# EAGLE design Regensensor (EAGLE 7.7.0)
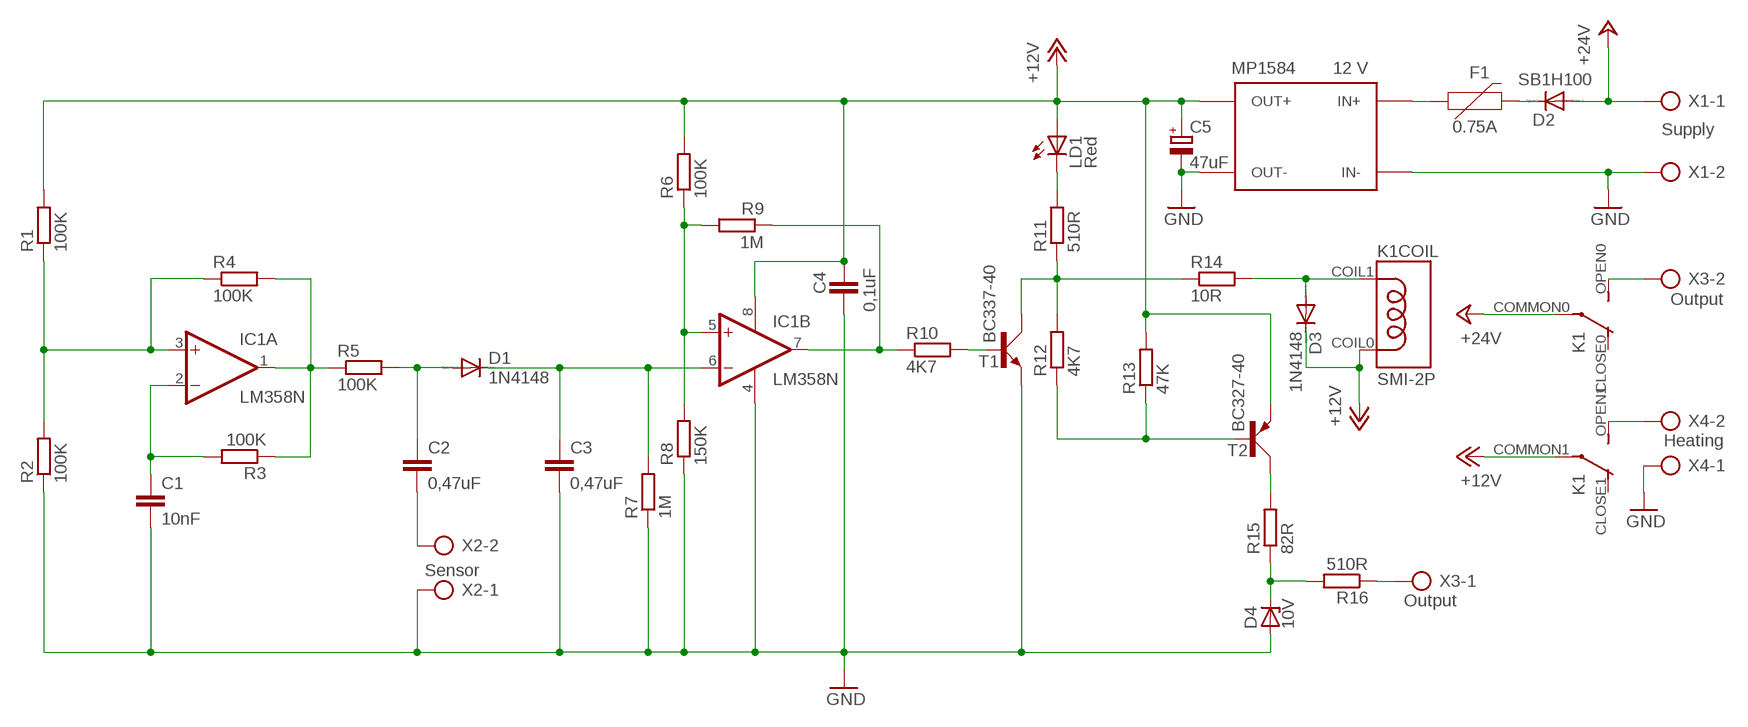
[diagram p0: schematic, sheet 1]

## Parts
C1  10nF  C-EU050-055X075  [C050-055X075]
C2  0,47uF  C-EU050-035X075  [C050-035X075]
C3  0,47uF  C-EU050-035X075  [C050-035X075]
C4  0,1uF  C-EU025-030X050  [C025-030X050]
C5  47uF  CPOL-EUE2.5-7  [E2,5-7]
D1  1N4148  1N4148DO35-2V  [DO35-2V]
D2  SB1H100  DIODE-DO41-7.6  [DO41-7.6]
D3  1N4148  1N4148DO35-7  [DO35-7]
D4  10V  ZENER-DIODEZD-2.5  [ZDIO-2.5]
F1  0.75A  PPTCRGEF250  [RGEF250]
IC1  LM358N  [DIL08]
K1  SMI-2P  [SMI]
LD1  Red  LED5MM  [LED5MM]
MP1584  12 V  DC-DC-STEP-DOWNMP1584  [MP1584]
R1  100K  R-EU_0204/2V  [0204V]
R2  100K  R-EU_0204/2V  [0204V]
R3  100K  R-EU_0204/2V  [0204V]
R4  100K  R-EU_0204/5  [0204/5]
R5  100K  R-EU_0204/2V  [0204V]
R6  100K  R-EU_0204/5  [0204/5]
R7  1M  R-EU_0204/2V  [0204V]
R8  150K  R-EU_0204/5  [0204/5]
R9  1M  R-EU_0204/5  [0204/5]
R10  4K7  R-EU_0204/5  [0204/5]
R11  510R  R-EU_0204/2V  [0204V]
R12  4K7  R-EU_0204/2V  [0204V]
R13  47K  R-EU_0204/2V  [0204V]
R14  10R  R-EU_0204/2V  [0204V]
R15  82R  R-EU_0204/2V  [0204V]
R16  510R  R-EU_0204/2V  [0204V]
T1  BC337-40  BC337LINE  [TO92-LINE]
T2  BC327-40  BC327LINE  [TO92-LINE]
X1  Supply  MKDS-3/25,08  [MKDSB-3/2-2]
X2  Sensor  MKDS-3/25,08  [MKDSB-3/2-2]
X3  Output  MKDS-3/25,08  [MKDSB-3/2-2]
X4  Heating  MKDS-3/25,08  [MKDSB-3/2-2]

## Nets
+12V: C4.1 C5.+ D3.C IC1.8(P:V+) K1.COIL0 K1.COMMON1(SWITCH1:COMMON) LD1.A MP1584.OUT+0(OUT+) MP1584.OUT+1(OUT+) R1.2 R6.2 R13.2 T2.1(E)
+24V: D2.A K1.COMMON0(SWITCH0:COMMON) X1.1
GND: C1.2 C3.2 C4.2 C5.- D4.A IC1.4(P:V-) MP1584.IN-0(IN-) MP1584.IN-1(IN-) MP1584.OUT-0(OUT-) MP1584.OUT-1(OUT-) R2.1 R7.1 R8.1 T1.1(E) X1.2 X2.1 X4.1
N$1: IC1.5(B:+IN) R6.1 R8.2 R9.2
N$2: IC1.7(B:OUT) R9.1 R10.1
N$3: C3.1 D1.C IC1.6(B:-IN) R7.2
N$4: C2.1 D1.A R5.2
N$5: R10.2 T1.2(B)
N$6: C1.1 IC1.2(A:-IN) R3.2
N$7: IC1.1(A:OUT) R3.1 R4.2 R5.1
N$8: F1.P$1 MP1584.IN+0(IN+) MP1584.IN+1(IN+)
N$9: IC1.3(A:+IN) R1.1 R2.2 R4.1
N$10: R11.1 R12.2 R14.1 T1.3(C)
N$11: R12.1 R13.1 T2.2(B)
N$12: LD1.K(C) R11.2
N$13: C2.2 X2.2
N$14: D3.A K1.COIL1 R14.2
N$15: D4.C R15.1 R16.2
N$16: K1.OPEN0(SWITCH0:OPEN) X3.2
N$17: K1.OPEN1(SWITCH1:OPEN) X4.2
N$18: D2.C F1.P$2
N$19: R15.2 T2.3(C)
N$20: R16.1 X3.1
Unconnected: K1.CLOSE0(SWITCH0:CLOSE) K1.CLOSE1(SWITCH1:CLOSE)

## Notes on the sheet
- Output

## Library data of the parts
C1-C4 = rcl:C-EU: CAPACITOR, European symbol
C5 = rcl:CPOL-EU: POLARIZED CAPACITOR, European symbol
D1 D3 = diode:1N4148: DIODE high speed (Philips)
D2 = diode:DIODE-: DIODE
D4 = diode:ZENER-DIODE: Z-Diode
F1 = ptc:PPTC: Resettable Fuse PPTC Resettable Fuse. Really a sort of resistor with a polymeric positive temperature coefficient whose resistance increases dramatically with an increase in temperature. When heated by the power passing through the resistance rises causing the current to be limited, protecting the circuit. This is achieved by the transition of the polymer from a crystalline to an amorphous state where the conductive carbon separates breaking the conductive pathways found in the cool crystalline structure. When a PPTC cools back down it resumes conducting letting the circuit turn back on.; PROD_ID: RES-08490; VALUE: 16V/2.5A
IC1 = linear:LM358: OP AMP also LM158; LM258; LM2904 Source: http://cache.national.com/ds/LM/LM158.pdf
K1 = songle:SMI-2P: Songle relay (SMI-2P) Source: http://www.songlerelay.com/Public/Uploads/20190921/5d8598d95868d.pdf
LD1 = led:LED: LED OSRAM: - CHIPLED LG R971, LG N971, LY N971, LG Q971, LY Q971, LO R971, LY R971 LH N974, LH R974 LS Q976, LO Q976, LY Q976 LO Q996 - Hyper CHIPLED LW Q18S LB Q993, LB Q99A, LB R99A - SideLED LS A670, LO A670, LY A670, LG A670, LP A670 LB A673, LV A673, LT A673, LW A673 LH A674 LY A675 LS A676, LA A676, LO A676, LY A676, LW A676 LS A679, LY A679, LG A679 - Hyper Micro SIDELED® LS Y876, LA Y876, LO Y876, LY Y876 LT Y87S - SmartLED LW L88C, LW L88S LB L89C, LB L89S, LG L890 LS L89K, LO L89K, LY L89K LS L896, LA L896, LO L896, LY L896 - TOPLED LS T670, LO T670, LY T670, LG T670, LP T670 LSG T670, LSP T670, LSY T670, LOP T670, LYG T670 LG T671, LOG T671, LSG T671 LB T673, LV T673, LT T673, LW T673 LH T674 LS T676, LA T676, LO T676, LY T676, LB T676, LH T676, LSB T676, LW T676 LB T67C, LV T67C, LT T67C, LS T67K, LO T67K, LY T67K, LW E67C LS E67B, LA E67B, LO E67B, LY E67B, LB E67C, LV E67C, LT E67C LW T67C LS T679, LY T679, LG T679 LS T770, LO T770, LY T770, LG T770, LP T770 LB T773, LV T773, LT T773, LW T773 LH T774 LS E675, LA E675, LY E675, LS T675 LS T776, LA T776, LO T776, LY T776, LB T776 LHGB T686 LT T68C, LB T68C - Hyper Mini TOPLED® LB M676 - Mini TOPLED Santana® LG M470 LS M47K, LO M47K, LY M47K Source: http://www.osram.convergy.de LUXEON: - LUMILED® LXK2-PW12-R00, LXK2-PW12-S00, LXK2-PW14-U00, LXK2-PW14-V00 LXK2-PM12-R00, LXK2-PM12-S00, LXK2-PM14-U00 LXK2-PE12-Q00, LXK2-PE12-R00, LXK2-PE12-S00, LXK2-PE14-T00, LXK2-PE14-U00 LXK2-PB12-K00, LXK2-PB12-L00, LXK2-PB12-M00, LXK2-PB14-N00, LXK2-PB14-P00, LXK2-PB14-Q00 LXK2-PR12-L00, LXK2-PR12-M00, LXK2-PR14-Q00, LXK2-PR14-R00 LXK2-PD12-Q00, LXK2-PD12-R00, LXK2-PD12-S00 LXK2-PH12-R00, LXK2-PH12-S00 LXK2-PL12-P00, LXK2-PL12-Q00, LXK2-PL12-R00 Source: www.luxeon.com KINGBRIGHT: KA-3528ASYC Source: www.kingbright.com
MP1584 = modules:DC-DC-STEP-DOWN: DC/DC Step-Down Regulator based on MP1584 chip
R1-R16 = rcl:R-EU_: RESISTOR, European symbol
T1 = transistor-small-signal:BC337: NPN TRANSISTOR
T2 = transistor-small-signal:BC327: PNP TRANSISTOR
X1-X4 = con-phoenix-mkds-3:MKDS-3/2: MKDS 3/2-508 Source: PHOENIX CONTACT

## Net classes
0 default: clearance 0.355 mm

## Board
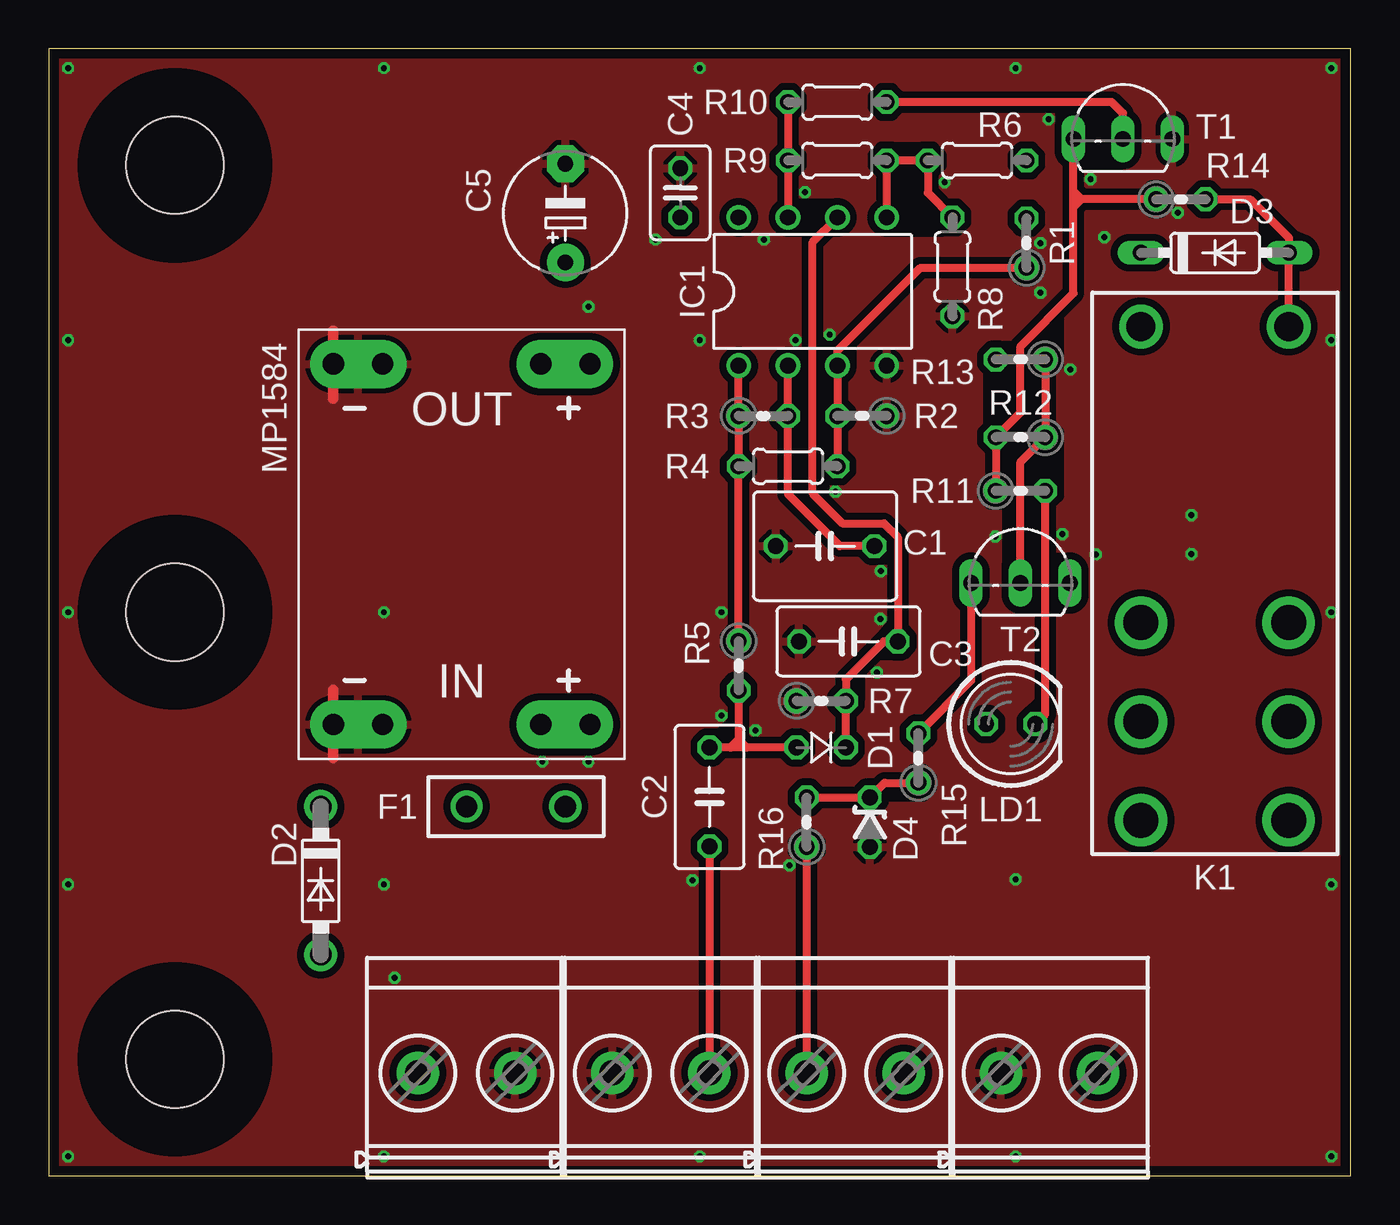
[diagram p1: board, top side]
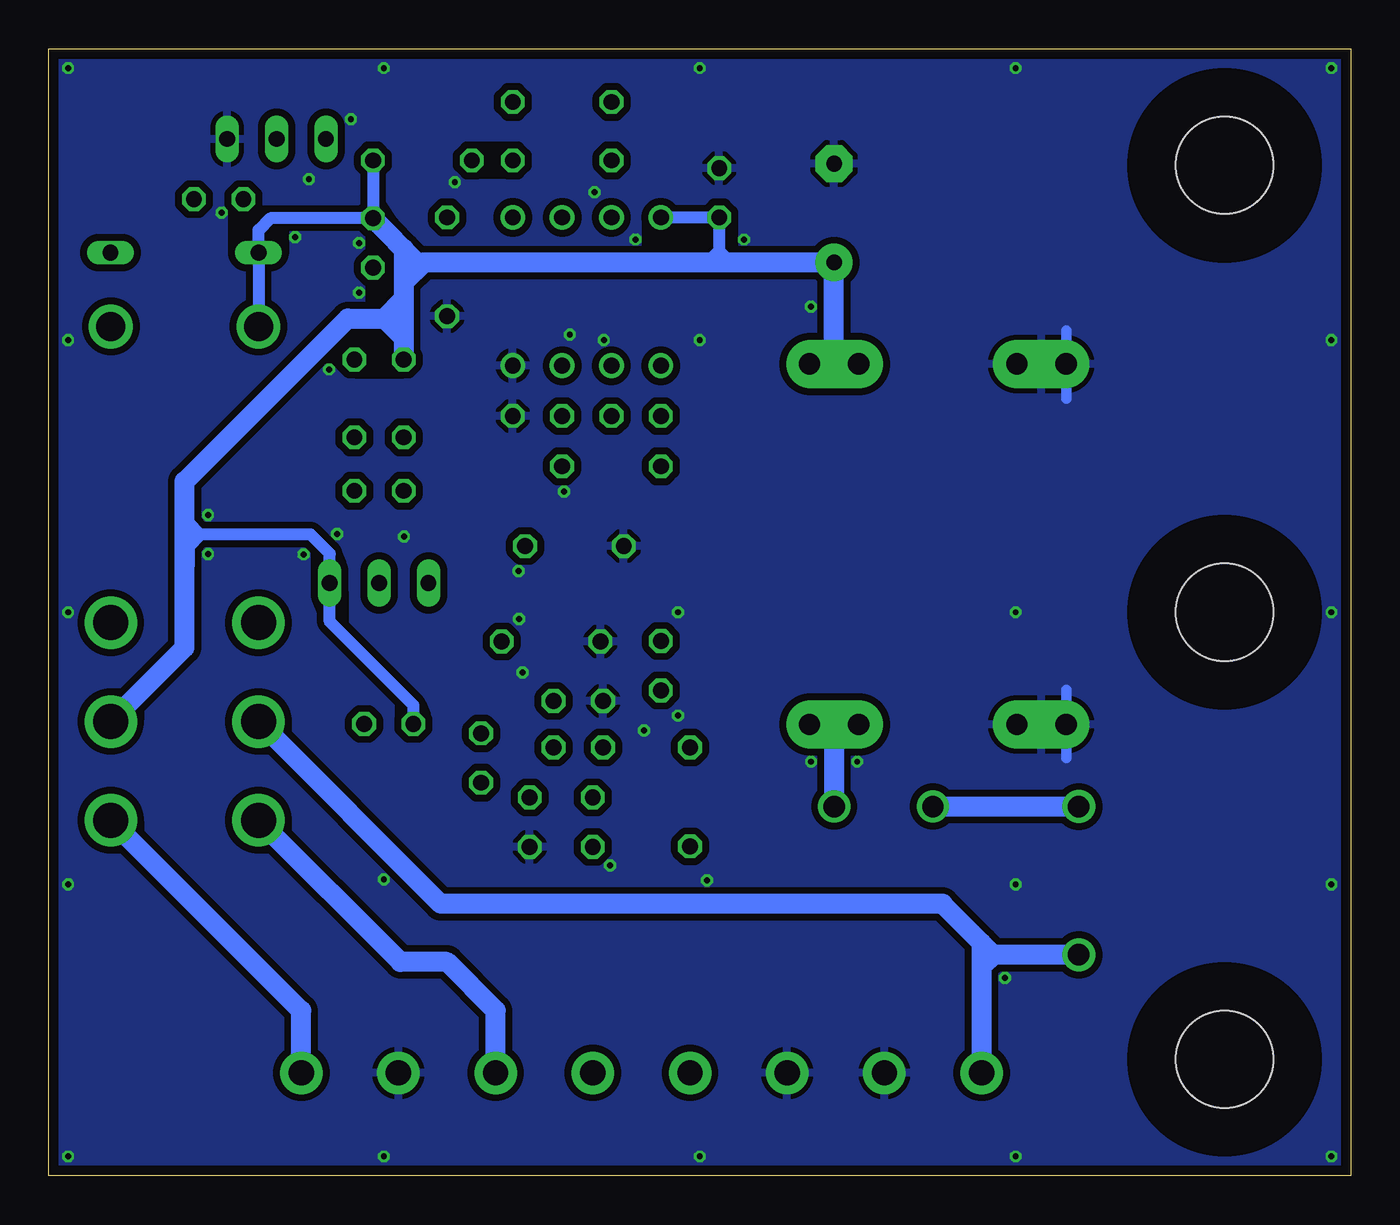
[diagram p2: board, bottom side, seen from below]

Size 67 x 58 mm. Coordinates in mm from the lower left corner, seen from the top.
Outline: 0,0 67,0 67,58 0,58 0,0
Copper layers (1*16): Top 0.035mm / dielectric 1.6mm / Bottom 0.035mm
Design rules "Elecrow": minimum track width 6mil, minimum drill 12mil, track to track 6mil, track to pad 8mil, pad to pad 12mil, via to via 12mil, smd to smd 0mil, copper to edge 20mil, drill to drill 10mil, minimum pad ring 6mil, minimum via ring 6mil, stop-mask expansion 0mil, vias tented up to drill 100mil, thermal gap 10mil
Holes 5 mm at 6.5,52 6.5,29 6.5,6
tRestrict: area 1.5,47 to 11.5,57; area 1.5,24 to 11.5,34; area 1.5,1 to 11.5,11; 27 lines
bRestrict: area 1.5,47 to 11.5,57; area 1.5,24 to 11.5,34; area 1.5,1 to 11.5,11; 25 lines

### Footprints (pad centres in the part's own frame; a part is rotated, then mirrored left to right if it is on the bottom)
C050-055X075 = drill 0.813 octagon: 1 -2.54,0; 2 2.54,0
C050-035X075 = drill 0.813 octagon: 1 -2.54,0; 2 2.54,0
C025-030X050 = drill 0.813 octagon: 1 -1.27,0; 2 1.27,0
E5-6 = drill 0.813 pad 1.905: + -2.54,0 | drill 0.813 pad 1.905 octagon: - 2.54,0
DO35-2V = drill 0.813 octagon: A 1.27,0; C -1.27,0
DO41-7.6 = drill 1.1 pad 1.7: A 3.81,0; C -3.81,0
DO35-7 = drill 0.813 long: A 3.81,0; C -3.81,0
ZDIO-2.5 = drill 0.813 octagon: A 1.27,0; C -1.27,0
RGEF250 = drill 1.1: P$1 -2.54,0; P$2 2.54,0
DIL08 = drill 0.813 pad 1.27: 1 -3.81,-3.81; 2 -1.27,-3.81; 3 1.27,-3.81; 4 3.81,-3.81; 5 3.81,3.81; 6 1.27,3.81; 7 -1.27,3.81; 8 -3.81,3.81
SMI = drill 1.8: CLOSE0 2.54,-3.8; CLOSE1 2.54,3.8; COMMON0 7.62,-3.8; COMMON1 7.62,3.8; OPEN0 12.7,-3.8; OPEN1 12.7,3.8 | drill 1.5: COIL0 -12.7,-3.8; COIL1 -12.7,3.8
LED5MM = drill 0.813 octagon: A -1.27,0; K 1.27,0
MP1584 = drill 1.1 pad 2.5 offset: IN+0 -9.271,-4.064; IN-0 -9.271,4.064; OUT+0 9.271,-4.064; OUT-0 9.271,4.064 | drill 1.1: IN+1 -9.271,-6.604; IN-1 -9.271,6.604; OUT+1 9.271,-6.604; OUT-1 9.271,6.604
0204V = drill 0.813 octagon: 1 -1.27,0; 2 1.27,0
0204/5 = drill 0.813 octagon: 1 -2.54,0; 2 2.54,0
TO92-LINE = drill 0.813 long: 1 2.54,0; 2 0,0; 3 -2.54,0
MKDSB-3/2-2 = drill 1.3 pad 2.184: 1 -2.5,0; 2 2.5,0

### Placement (x,y rotation side)
C1  39.95,32.4 180 top
C2  34,19.5 270 top
C3  41.15,27.5 180 top
C4  32.5,50.58 90 top
C5  47uF  [E5-6]  26.58,49.54 90 top
D1  39.75,22.04 180 top
D2  14,15.19 270 top
D3  60.01,47.5 0 top
D4  42.25,18.2 270 top
F1  24.04,19 180 top
IC1  39.31,45.5 0 top
K1  60,31 270 top
LD1  49.5,23.25 0 top
MP1584  21.25,32.5 90 top
R1  50.31,48 90 top
R2  41.85,39.1 180 top
R3  36.77,39.1 0 top
R4  38.04,36.51 180 top
R5  35.5,26.25 270 top
R6  47.77,52.25 0 top
R7  39.75,24.44 0 top
R8  46.5,46.77 90 top
R9  40.58,52.25 0 top
R10  40.58,55.25 0 top
R11  50,35.25 0 top
R12  50,38 180 top
R13  50,42 180 top
R14  58.25,50.25 0 top
R15  44.75,21.5 90 top
R16  39,18.2 90 top
T1  55.27,53.35 0 top
T2  50,30.5 0 top
X1  21.5,5.3 0 top
X2  31.5,5.3 0 top
X3  41.5,5.3 0 top
X4  51.5,5.3 0 top

### Tracks (layer width: path | path; a pad name or v marks a point on that pad's centre or on a via)
+12V
  Bottom 0.61: K1.COIL0 D3.C 56.2,48.66 55.59,49.27 R1.2 R6.2 | IC1.8 C4.1 32.5,47.61 | 32.5,47.61 33.11,47 | 32.5,47.61 31.89,47 | LD1.A 48.23,24.21 52.54,28.52 T2.1 52.54,32.02 53.52,33 59.19,33 | 59.19,33 59.8,33.61 59.8,34.7 59.94,34.7 60,34.76 | 59.19,33 59.8,32.39 59.8,31.36
  Bottom 1.016: MP1584.OUT+1 26.58,41.77 C5.+ 31.89,47 33.11,47 47.71,47 | K1.COMMON1 60,27.18 60,34.76 60,35.73 51.61,44.12 49.75,44.12 | 48.73,45.98 48.73,45.14 | 48.73,45.14 48.73,43.1 | 48.73,43.1 R13.2 | 47.71,47 48.73,45.98 | 48.73,47.69 48.73,45.98 | R1.2 48.04,47 47.71,47 | 49.75,44.12 48.73,45.14 | 49.75,44.12 48.73,43.1
+24V
  Bottom 1.016: 19,11.99 19,10.77 | 18.39,11.38 19,10.77 | 19,10.77 X1.1 | D2.A 18.39,11.38 | 18.39,11.38 19,11.99 | K1.COMMON0 46.82,14 21.01,14 19,11.99
GND  (via drill 0.3)
  Top 0.548: 14.65,43.5 14.65,40 | 14.65,25 14.65,21.5
  Bottom 0.548: 14.65,43.5 14.65,40 | 14.65,25 14.65,21.5
  other vias: 66,57 66,43 66,29 66,15 66,1 49.75,57 33.5,57 17.25,57 1,57 1,43 1,29 1,15 1,1 25.4,21.31 27.77,21.31 38.11,15.98 17.25,29 17.25,15 51.02,45.44 58.8,31.99 49.75,15.25 51.02,48 54.31,48.29 58.1,49.55 33.12,15.2 34.62,29 33.5,43 51.45,54.37 40.19,43.29 38.92,50.62 52.57,41.49 48.72,32.9 42.82,31.12 46.1,51.12 17.25,1 49.75,1 33.5,1 53.61,51.29 36.81,48.18 38.44,43 31.22,48.18 34.62,23.68 52.15,33.02 58.8,34.01 53.87,31.98 40.49,35.21 42.8,28.65 42.62,25.91 36.37,22.91 27.78,44.72 17.81,10.19
  pour Bottom: 0,58 67,58 67,0 0,0
  pour Top: 0,58 67,58 67,0 0,0
N$1
  Top 0.406: R8.2 45.23,50.58 R6.1 R9.2 IC1.5
N$2
  Top 0.406: IC1.7 R9.1 R10.1
N$3
  Top 0.406: D1.C R7.2 41.02,25.55 42.97,27.5 C3.1 43.69,32.86 42.98,33.57 40.85,33.57 39.31,35.11 39.31,48.04 IC1.6
N$4
  Top 0.406: D1.A 35.91,22.04 | 35.91,22.04 35.09,22.04 | 35.09,22.04 C2.1 | 35.5,22.45 35.91,22.04 | R5.2 35.5,22.45 | 35.5,22.45 35.09,22.04
N$5
  Top 0.406: T1.2 55.27,54.68 54.7,55.25 R10.2
N$6
  Top 0.406: IC1.2 R3.2 38.04,35.07 40.71,32.4 C1.1
N$7
  Top 0.406: R5.1 R4.2 R3.1 IC1.1
N$8
  Bottom 1.016: MP1584.IN+1 26.58,23.23 F1.P$1
N$9
  Top 0.406: R4.1 R2.2 IC1.3 40.58,42.45 44.86,46.73 R1.1
N$10
  Top 0.406: R11.1 R12.2 50,39.27 50,42.68 52.73,45.41 52.73,49.84 | 52.73,49.84 52.73,50.66 | 52.73,50.66 T1.3 | 53.14,50.25 52.73,50.66 | R14.1 53.14,50.25 | 53.14,50.25 52.73,49.84
N$11
  Top 0.406: R13.1 R12.1 50,36.73 T2.2
N$12
  Top 0.406: R11.2 51.27,23.75 LD1.K
N$13
  Top 0.406: C2.2 X2.2
N$14
  Top 0.406: K1.COIL1 63.8,47.48 D3.A 63.82,48.25 61.82,50.25 R14.2
N$15
  Top 0.406: R16.2 D4.C 43.01,20.23 R15.1
N$16
  Bottom 1.016: X3.2 44,8.5 46.5,11 48.9,11 K1.OPEN0
N$17
  Bottom 1.016: X4.2 54,8.5 K1.OPEN1
N$18
  Bottom 1.016: F1.P$2 D2.C
N$19
  Top 0.406: T2.3 47.46,25.48 R15.2
N$20
  Top 0.406: R16.1 X3.1

### Text on the board
tDocu: Rain sensor | Supply | Sensor | Output | Heating | +24V | GND | GND | IN | +10V | +24V | GND | +12V